# Altium schematic sheet DUAL_SIM_INTERFACE.SchDoc
size A4; SheetNumber: 17; SheetTotal: 27
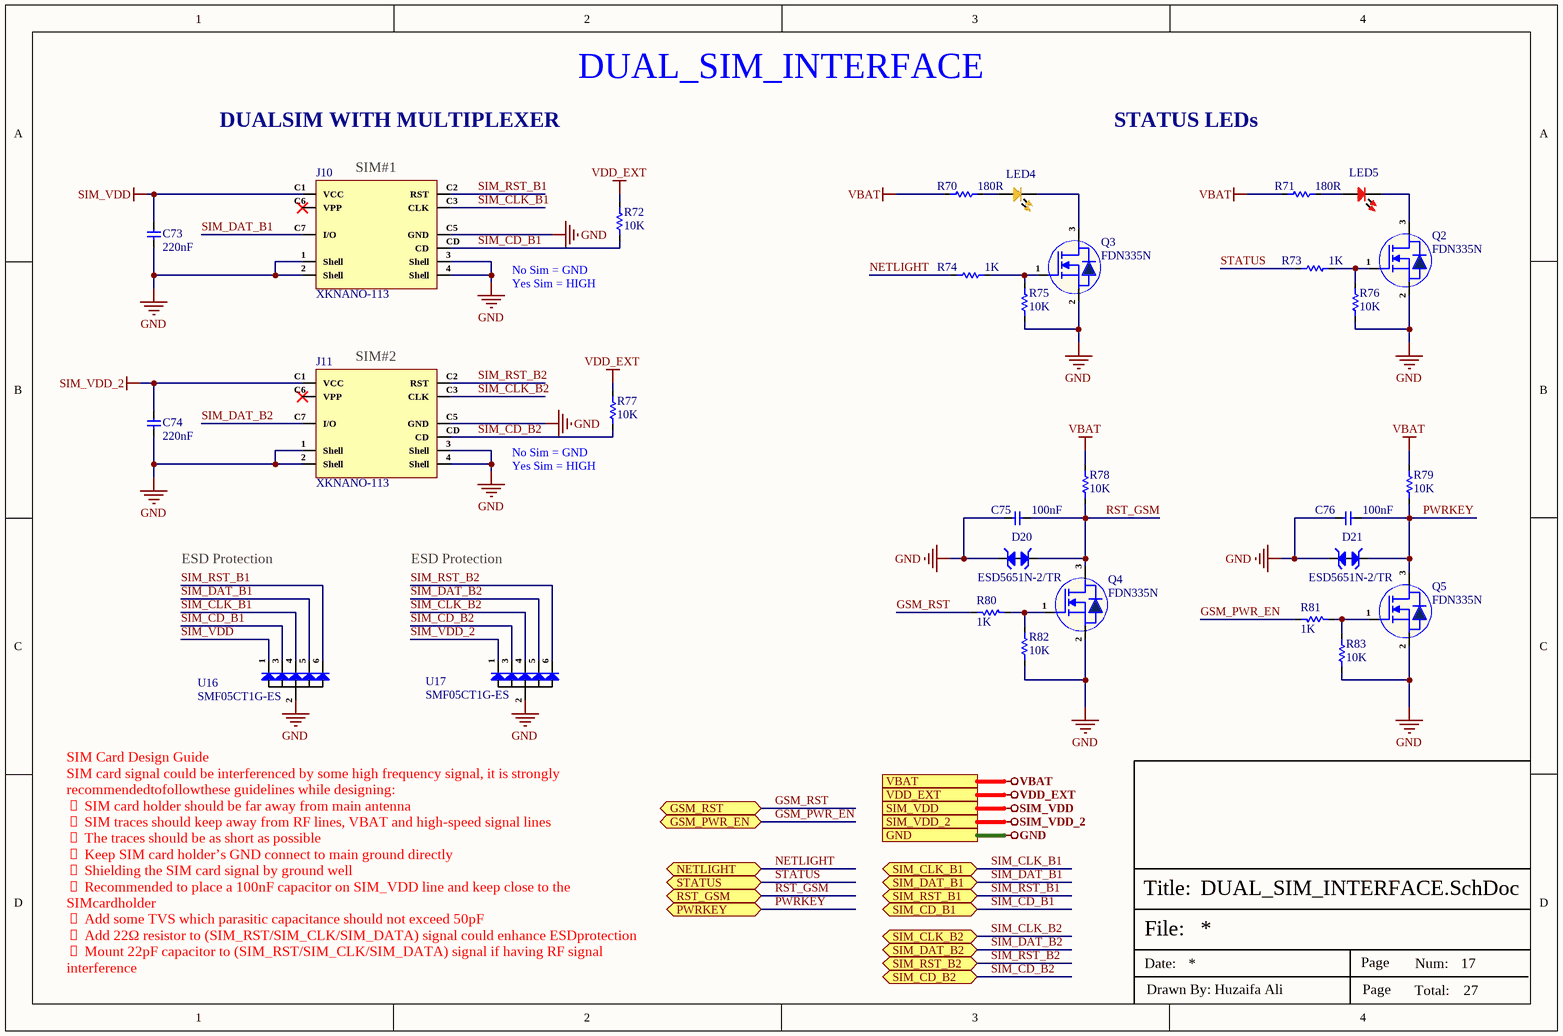
[diagram p0: DUAL_SIM_INTERFACE.SchDoc]

## Parts
C73  220nF  [Cap-0402]
C74  220nF  [Cap-0402]
C75  100nF  [Cap-0402]
C76  100nF  [Cap-0402]
D20  ESD5651N-2/TR  [DFN1006-2L_]
D21  ESD5651N-2/TR  [DFN1006-2L_]
J10  XKNANO-113  [XKNANO-113]
J11  XKNANO-113  [XKNANO-113]
LED4  Yellow  [LED-0402]  (value not drawn)
LED5  Red  [LED-0402]  (value not drawn)
Q2  FDN335N  [SOT-23]
Q3  FDN335N  [SOT-23]
Q4  FDN335N  [SOT-23]
Q5  FDN335N  [SOT-23]
R70  180R  [Res-0603]
R71  180R  [Res-0603]
R72  10K  [Res-0402]
R73  1K  [Res-0402]
R74  1K  [Res-0402]
R75  10K  [Res-0402]
R76  10K  [Res-0402]
R77  10K  [Res-0402]
R78  10K  [Res-0402]
R79  10K  [Res-0402]
R80  1K  [Res-0402]
R81  1K  [Res-0402]
R82  10K  [Res-0402]
R83  10K  [Res-0402]
U16  SMF05CT1G-ES  [SOT-363]
U17  SMF05CT1G-ES  [SOT-363]

## Ports
GND (see TOP SHEET[5B], AUDIO_INTERFACE[1D], BUCK REGULATOR[3D], DEBUG_UART_INTERFACE[3D], DIGITAL IO_RELAY_SHEET[5D], ETHERNET_PHY0[4D], ETHERNET_PHY1[4D], GSM_INTERFACE[2D], HDMI_INTERFACE[3D], INPUT_PROTECTION[3D], LINEAR_VOLTAGE_REG[3D], MICRO_SD_INTERFACE[3D], MIPI-DSI DISPLAY[3D], POWER SECTION[3D], PUSH BUTTONs_INTERFACE[3C], RGB_LEDs_INTERFACE[3D], ROCKCHIP_PWR_SUPPLY[1D], ROCKCHIP_SYSTEM_CONTROL[3C], RS232_RS485_INTERFACE[3C], SENSOR_SHEET[3D], USB2.0_INTERFACE[3D], USB3.0_INTERFACE[3D], USB-C_INTERFACE[2D], WIEGAND_INTERFACE[3D], WIFI_BLUETOOTH_SHEET[4C]), GSM_PWR_EN (bidir, see TOP SHEET[6B], ROCKCHIP_GPIO_NC PINS[3D]), GSM_RST (bidir, see TOP SHEET[6B], ROCKCHIP_GPIO_NC PINS[3D]), NETLIGHT (bidir, see TOP SHEET[5B], GSM_INTERFACE[3D]), PWRKEY (bidir, see TOP SHEET[5B], GSM_INTERFACE[3D]), RST_GSM (bidir, see TOP SHEET[5B], GSM_INTERFACE[3D]), SIM_CD_B1 (bidir, see TOP SHEET[5A], GSM_INTERFACE[3D]), SIM_CD_B2 (bidir, see TOP SHEET[5A], GSM_INTERFACE[3D]), SIM_CLK_B1 (bidir, see TOP SHEET[5A], GSM_INTERFACE[3D]), SIM_CLK_B2 (bidir, see TOP SHEET[5A], GSM_INTERFACE[3D]), SIM_DAT_B1 (bidir, see TOP SHEET[5A], GSM_INTERFACE[3D]), SIM_DAT_B2 (bidir, see TOP SHEET[5A], GSM_INTERFACE[3D]), SIM_RST_B1 (bidir, see TOP SHEET[5A], GSM_INTERFACE[3D]), SIM_RST_B2 (bidir, see TOP SHEET[5A], GSM_INTERFACE[3D]), SIM_VDD (see TOP SHEET[5A], GSM_INTERFACE[1D]), SIM_VDD_2 (see TOP SHEET[5A], GSM_INTERFACE[1D]), STATUS (bidir, see TOP SHEET[5B], GSM_INTERFACE[3D]), VBAT (see TOP SHEET[5B], GSM_INTERFACE[2D]), VDD_EXT (see TOP SHEET[5B], GSM_INTERFACE[2D])

## Nets
GND: C73.2 C74.2 C75.1 C76.1 D20.1(K) D21.1(K) J10.1(Shell) J10.2(Shell) J10.3(Shell) J10.4(Shell) J10.C5(GND) J11.1(Shell) J11.2(Shell) J11.3(Shell) J11.4(Shell) J11.C5(GND) Q2.2(S) Q3.2(S) Q4.2(S) Q5.2(S) R75.1 R76.1 R82.1 R83.1 U16.2(A) U17.2(A) ; port GND
SIM_VDD: C73.1 J10.C1(VCC) U16.1(IO1) ; port SIM_VDD
SIM_VDD_2: C74.1 J11.C1(VCC) U17.1(IO1) ; port SIM_VDD_2
VBAT: R70.2 R71.2 R78.2 R79.2 ; port VBAT
VDD_EXT: R72.2 R77.2 ; port VDD_EXT
GSM_PWR_EN: R81.2 ; port GSM_PWR_EN
GSM_RST: R80.1 ; port GSM_RST
NETLIGHT: R74.1 ; port NETLIGHT
PWRKEY: C76.2 D21.2(K) Q5.3(D) R79.1 ; port PWRKEY
RST_GSM: C75.2 D20.2(K) Q4.3(D) R78.1 ; port RST_GSM
SIM_CD_B1: J10.CD R72.1 U16.3(IO2) ; port SIM_CD_B1
SIM_CD_B2: J11.CD R77.1 U17.3(IO2) ; port SIM_CD_B2
SIM_CLK_B1: J10.C3(CLK) U16.4(IO3) ; port SIM_CLK_B1
SIM_CLK_B2: J11.C3(CLK) U17.4(IO3) ; port SIM_CLK_B2
SIM_DAT_B1: J10.C7(I/O) U16.5(IO4) ; port SIM_DAT_B1
SIM_DAT_B2: J11.C7(I/O) U17.5(IO4) ; port SIM_DAT_B2
SIM_RST_B1: J10.C2(RST) U16.6(IO5) ; port SIM_RST_B1
SIM_RST_B2: J11.C2(RST) U17.6(IO5) ; port SIM_RST_B2
STATUS: R73.1 ; port STATUS
NetLED4_1: LED4.1 R70.1
NetLED4_2: LED4.2 Q3.3(D)
NetLED5_1: LED5.1 R71.1
NetLED5_2: LED5.2 Q2.3(D)
NetQ2_1: Q2.1(G) R73.2 R76.2
NetQ3_1: Q3.1(G) R74.2 R75.2
NetQ4_1: Q4.1(G) R80.2 R82.2
NetQ5_1: Q5.1(G) R81.1 R83.2

Not connected (* = marked no-connect by the designer): J10 C6(VPP)*; J11 C6(VPP)*

## Notes on the sheet
- DUALSIM WITH MULTIPLEXER
- DUAL_SIM_INTERFACE
- STATUS LEDs
- (near J10) SIM#1
- (near R72) No Sim = GND
  Yes Sim = HIGH
- (near J11) SIM#2
- (near R77) No Sim = GND
  Yes Sim = HIGH
- ESD Protection
- SIM Card Design Guide
  SIM card signal could be interferenced by some high frequency signal, it is strongly recommendedtofollowthese guidelines while designing:
   SIM card holder should be far away from main antenna
   SIM traces should keep away from RF lines, VBAT and high-speed signal lines
   The traces should be as short as possible
   Keep SIM card holder’s GND connect to main ground directly
   Shielding the SIM card signal by ground well
   Recommended to place a 100nF capacitor on SIM_VDD line and keep close to the SIMcardholder
   Add some TVS which parasitic capacitance should not exceed 50pF
   Add 22Ω resistor to (SIM_RST/SIM_CLK/SIM_DATA) signal could enhance ESDprotection  Mount 22pF capacitor to (SIM_RST/SIM_CLK/SIM_DATA) signal if having RF signal interference
  Datasheet Pg 31
- File:
- Title:
- Date:
- Page
- Num:
- Total:
- Drawn By: Huzaifa Ali

## Library data of the parts
C73 C74 = CC0402KRX5R8BB224: CAP CER 0.22UF 25V X5R 0402; Manufacturer: Yageo; Tolerance: 10%; Manufacturer Part Number: CC0402KRX5R8BB224; RoHS: Yes; Category: Ceramic Capacitors; Supplier 1: Mouser; Stock 1: 61266; Pricing 1: 1=0.10000, 10=0.03300, 50=0.03300, 100=0.02700, 1000=0.01500, 10000=0.01300 (USD); Mount: Surface Mount; Case/Package: 0402; Min Operating Temperature: -55°C; Max Operating Temperature: 85°C; Capacitance: 220nF; Dielectric: X5R; Packaging: Tape and Reel; Voltage Rating: 25V; Voltage Rating (DC): 25V; Length: 0.039inch; Width: 0.02inch; Thickness: 0.022inch; Lead Free: Lead Free; Halogen Free: Halogen Free; RoHS Compliant: Yes; ComponentLink1URL: http://www.yageo.com/documents/recent/UPY-GPHC_X5R_4V-to-50V_25.pdf?src-supplier=Digi-Key; ComponentLink1Description: http://www.yageo.com/documents/recent/UPY-GPHC_X5R_4V-to-50V_25.pdf?src-supplier=Digi-Key; ComponentLink2URL: https://www.yageo.com/upload/media/product/productsearch/datasheet/mlcc/UPY-GPHC_X5R_4V-to-50V_26.pdf?src-supplier=Digi-Key; ComponentLink2Description: https://www.yageo.com/upload/media/product/productsearch/datasheet/mlcc/UPY-GPHC_X5R_4V-to-50V_26.pdf?src-supplier=Digi-Key; ComponentLink3URL: http://www.yageo.com/documents/recent/UPY-GPHC_X5R_4V-to-50V_23.pdf?src-supplier=Digi-Key; ComponentLink3Description: http://www.yageo.com/documents/recent/UPY-GPHC_X5R_4V-to-50V_23.pdf?src-supplier=Digi-Key; Supplier Part Number 1: 603-CC402KRX5R8BB224; LCSC Part Number: C326836
C75 C76 = CC0402KRX5R7BB104: CAP CER 0.1UF 16V X5R 0402; Manufacturer: Yageo; Tolerance: 10%; Manufacturer Part Number: CC0402KRX5R7BB104; RoHS: Yes; Category: Ceramic Capacitors; Supplier 1: Mouser; Stock 1: 936792; Pricing 1: 1=0.10000, 10=0.02300, 50=0.02300, 100=0.01100, 1000=0.00600, 10000=0.00400 (USD); Mount: Surface Mount; Case/Package: 0402; Number of Pins: 2; Case Code (Metric): 1005; Case Code (Imperial): 0402; Min Operating Temperature: -55°C; Max Operating Temperature: 85°C; Capacitance: 100nF; Dielectric: X5R; Packaging: Tape and Reel; Voltage Rating: 16V; Package Quantity: 1; Voltage Rating (DC): 16V; Termination: SMD/SMT; Resistor Type: Ceramic; Series: CC; Construction: Flat; Length: 1mm; Width: 0.02inch; Height: 0.5mm; Thickness: 0.022inch; Depth: 0.5mm; Radiation Hardening: No; REACH SVHC: Unknown; Lead Free: Lead Free; Halogen Free: Halogen Free; RoHS Compliant: Yes; ComponentLink1URL: https://datasheet.ciiva.com/155/mlccorderingcode-155879.pdf?src-supplier=Digi-Key; ComponentLink1Description: https://datasheet.ciiva.com/155/mlccorderingcode-155879.pdf?src-supplier=Digi-Key; ComponentLink2URL: https://datasheet.ciiva.com/155/mlccorderingcode-155878.pdf?src-supplier=Digi-Key; ComponentLink2Description: https://datasheet.ciiva.com/155/mlccorderingcode-155878.pdf?src-supplier=Digi-Key; ComponentLink3URL: https://datasheet.ciiva.com/155/mlccorderingcode-155880.pdf?src-supplier=Digi-Key; ComponentLink3Description: https://datasheet.ciiva.com/155/mlccorderingcode-155880.pdf?src-supplier=Digi-Key; ComponentLink4URL: https://datasheet.ciiva.com/11464/upy-gphc-x5r-4v-to-50v-12-11464869.pdf?src-supplier=Avnet; ComponentLink4Description: https://datasheet.ciiva.com/11464/upy-gphc-x5r-4v-to-50v-12-11464869.pdf?src-supplier=Avnet; Supplier Part Number 1: 603-CC402KRX5R7BB104; LCSC Part Number: C106204
D20 D21 = ESD5651N-2/TR: 35A@8/20us 15V 4.5V@Max DFN1006-2L Electrostatic and Surge Protection (TVS/ESD) ROHS; Manufacturer: WILLSEMI(Will Semicon); Item Type: Diode; Manufacturer Part Number: ESD5651N-2/TR; Package: DFN1006; LCSC Part Number: C239784; ComponentLink1Description: LCSC; ComponentLink1URL: https://www.lcsc.com/product-detail/TVS_WILLSEMI-Will-Semicon-ESD5651N-2-TR_C239784.html
J10 J11 = XKNANO-113: Copper Alloy Self bomb Gold plating 1.25mm Deck -40℃~+85℃ 260℃ NanoSIM SMD SIM Card Connectors ROHS; Manufacturer: XKB Connectivity; Manufacturer Part Number: XKNANO-113; Package: SMD Custom; LCSC Part Number: C381071; Item Type: SIM Card Connectors; ComponentLink1Description: LCSC; ComponentLink1URL: https://www.lcsc.com/product-detail/SIM-Card-Connectors_XKB-Connectivity-XKNANO-113_C381071.html
LED4 = XZMYK68W-2: LED YELLOW CLEAR CHIP SMD; Manufacturer: SunLED; Lens Color: Colorless; Luminous Intensity: 148mcd; Test Current: 20mA; Viewing Angle: 120°; Dominant Wavelength: 590nm; Forward Voltage: 2V; Supplier 1: Digi-Key; Manufacturer Part Number: XZMYK68W-2; RoHS: Yes; Category: LEDs; Stock 1: 36021; Pricing 1: 1=0.36000, 10=0.28400, 100=0.12770, 500=0.11536, 1000=0.09476 (USD); Mount: Surface Mount; Case/Package: 0402; Color: Yellow; Case Code (Metric): 1005; Case Code (Imperial): 0402; Packaging: Tape and Reel; Lens Transparency: Clear; Length: 1mm; Width: 0.5mm; Height: 0.6mm; RoHS Compliant: Yes; ComponentLink1URL: http://www.sunledusa.com/products/spec/XZMYK68W-2.pdf?src-supplier=Digi-Key; ComponentLink1Description: http://www.sunledusa.com/products/spec/XZMYK68W-2.pdf?src-supplier=Digi-Key; Supplier Part Number 1: 1497-1198-1-ND; Item Type: LED
LED5 = XZMDK68W-2: LED RED CLEAR CHIP SMD; Manufacturer: SunLED; Lens Color: Colorless; Luminous Intensity: 69mcd; Test Current: 20mA; Viewing Angle: 120°; Dominant Wavelength: 630nm; Forward Voltage: 1.95V; Supplier 1: Digi-Key; Manufacturer Part Number: XZMDK68W-2; Stock 1: 69539; Pricing 1: 1=0.43, 10=0.306, 100=0.136, 500=0.0952, 1000=0.0782 (USD); Mount: Surface Mount; Case/Package: 0402; Color: Red; Case Code (Metric): 1005; Case Code (Imperial): 0402; Packaging: Tape and Reel; Lens Transparency: Clear; Length: 1mm; Height: 0.6mm; Width: 0.5mm; ComponentLink1URL: http://www.sunledusa.com/products/spec/XZMDK68W-2.pdf?src-supplier=Digi-Key; ComponentLink1Description: http://www.sunledusa.com/products/spec/XZMDK68W-2.pdf?src-supplier=Digi-Key; ComponentLink2URL: https://www.sunledusa.com/products/spec/XZMDK68W-2.pdf?src-supplier=Digi-Key; ComponentLink2Description: https://www.sunledusa.com/products/spec/XZMDK68W-2.pdf?src-supplier=Digi-Key; Supplier Part Number 1: 1497-1174-6-ND; Item Type: LED
Q2-Q5 = FDN335N: SOT-23 MOSFETs ROHS; Manufacturer: TECH PUBLIC; Item Type: Mosfet; Manufacturer Part Number: FDN335N; Package: SOT-23; LCSC Part Number: C5123904; ComponentLink1Description: LCSC; ComponentLink1URL: https://www.lcsc.com/product-detail/MOSFETs_TECH-PUBLIC-FDN335N_C5123904.html
R70 R71 = RC0603FR-07180RL: RES 180 OHM 1% 1/10W 0603; Manufacturer: Yageo; Max Power Dissipation: 100mW; Temperature Coefficient: 100ppm/°C; Item Type: Resistor; Voltage Rating (DC): 50V; Manufacturer Part Number: RC0603FR-07180RL; RoHS: Yes; Category: Chip SMD Resistors; Case/Package: 0603; Min Operating Temperature: -55°C; Max Operating Temperature: 155°C; Packaging: Tape and Reel; Number of Terminations: 2; Tolerance: 1%; Features: Moisture Resistant; Series: RC; Length: 1.6mm; Width: 0.8mm; Height: 0.022inch; RoHS Compliant: Yes; ComponentLink1URL: https://datasheet.ciiva.com/2454/pyu-r-int-thick-7-2454469.pdf?src-supplier=Digi-Key; ComponentLink1Description: https://datasheet.ciiva.com/2454/pyu-r-int-thick-7-2454469.pdf?src-supplier=Digi-Key; ComponentLink2URL: https://datasheet.ciiva.com/2454/pyu-r-int-thick-7-2454470.pdf?src-supplier=Digi-Key; ComponentLink2Description: https://datasheet.ciiva.com/2454/pyu-r-int-thick-7-2454470.pdf?src-supplier=Digi-Key; LCSC Part Number: C137786; Supplier 1: Avnet; Stock 1: 35000; Pricing 1: 5000=0.00133, 10000=0.00131, 20000=0.00127 (USD); Number of Pins: 2; Case Code (Metric): 1608; Case Code (Imperial): 0603; Size Code: 0603; Resistance: 180R; Power Rating: 100mW; Package Quantity: 1; Voltage Rating: 50V; Resistor Type: Thick Film; Termination: SMD/SMT; Construction: Rectangular; Resistance Tolerance: 1%; Depth: 0.8mm; Lead Free: Lead Free; Military Standard: Not; ComponentLink3URL: https://datasheet.ciiva.com/2454/pyu-r-int-thick-7-2454468.pdf?src-supplier=Digi-Key; ComponentLink3Description: https://datasheet.ciiva.com/2454/pyu-r-int-thick-7-2454468.pdf?src-supplier=Digi-Key; ComponentLink4URL: https://datasheet.ciiva.com/7746/443971-7746267.pdf?src-supplier=Element14; ComponentLink4Description: https://datasheet.ciiva.com/7746/443971-7746267.pdf?src-supplier=Element14; ComponentLink5URL: https://datasheet.ciiva.com/7746/443971-7746266.pdf?src-supplier=Element14; ComponentLink5Description: https://datasheet.ciiva.com/7746/443971-7746266.pdf?src-supplier=Element14; ComponentLink6URL: https://datasheet.ciiva.com/15189/getdatasheetpartid-325160-15189622.pdf?src-supplier=Verical; ComponentLink6Description: https://datasheet.ciiva.com/15189/getdatasheetpartid-325160-15189622.pdf?src-supplier=Verical; Supplier Part Number 1: RC0603FR-07180RL
R72 R77-R79 R82 R83 = RC0402FR-0710KL: RES 10K OHM 1% 1/16W 0402; Manufacturer: Yageo; Max Power Dissipation: 63mW; Temperature Coefficient: 100ppm/°C; Resistance: 10kR; Voltage Rating (DC): 50V; Power Rating: 62.5mW; Item Type: Resistor; Manufacturer Part Number: RC0402FR-0710KL; RoHS: Yes; Category: Chip SMD Resistors; Case/Package: 0402; Case Code (Imperial): 0402; Case Code (Metric): 1005; Min Operating Temperature: -55°C; Max Operating Temperature: 155°C; Features: Moisture Resistant; Packaging: Tape and Reel; Tolerance: 1%; Number of Terminations: 2; Series: RC; RoHS Compliant: Yes; ComponentLink1URL: https://datasheet.ciiva.com/7660/38568-7660787.pdf?src-supplier=Element14; ComponentLink1Description: https://datasheet.ciiva.com/7660/38568-7660787.pdf?src-supplier=Element14; Supplier 1: Mouser; Stock 1: 18648329; Pricing 1: 1=0.10000, 10=0.01400, 50=0.01400, 100=0.00500, 1000=0.00300, 10000=0.00200 (USD); Number of Pins: 2; Resistor Type: Thick Film; Voltage Rating: 50V; Termination: SMD/SMT; Resistance Tolerance: 1%; Construction: Rectangular; Length: 1mm; Width: 0.5mm; Height: 0.32mm; Depth: 0.5mm; Lead Pitch: 0.2mm; REACH SVHC: No SVHC; Lead Free: Lead Free; Military Standard: Not; ComponentLink2URL: https://datasheet.ciiva.com/7849/1686128-7849814.pdf?src-supplier=Element14; ComponentLink2Description: https://datasheet.ciiva.com/7849/1686128-7849814.pdf?src-supplier=Element14; ComponentLink3URL: https://datasheet.ciiva.com/7983/1018594-7983486.pdf?src-supplier=Element14; ComponentLink3Description: https://datasheet.ciiva.com/7983/1018594-7983486.pdf?src-supplier=Element14; ComponentLink4URL: https://datasheet.ciiva.com/22747/1018594-22747512.pdf?src-supplier=Element14; ComponentLink4Description: https://datasheet.ciiva.com/22747/1018594-22747512.pdf?src-supplier=Element14; ComponentLink5URL: https://datasheet.ciiva.com/12667/pyu-rc0402-51-rohs-l-6-r-12667067.pdf?src-supplier=Mouser; ComponentLink5Description: https://datasheet.ciiva.com/12667/pyu-rc0402-51-rohs-l-6-r-12667067.pdf?src-supplier=Mouser; ComponentLink6URL: https://datasheet.ciiva.com/7849/1784430-7849813.pdf?src-supplier=Element14; ComponentLink6Description: https://datasheet.ciiva.com/7849/1784430-7849813.pdf?src-supplier=Element14; Supplier Part Number 1: 603-RC0402FR-0710KL; LCSC Part Number: C60490; Working Voltage: 50V; ComponentLink7URL: https://datasheet.ciiva.com/7849/1784430-7849815.pdf?src-supplier=Element14; ComponentLink7Description: https://datasheet.ciiva.com/7849/1784430-7849815.pdf?src-supplier=Element14
R73 R74 R80 R81 = RC0402FR-071KL: RES 1K OHM 1% 1/16W 0402; Manufacturer: Yageo; Resistance: 1kR; Temperature Coefficient: 100ppm/°C; Voltage Rating (DC): 50V; Power Rating: 62.5mW; Max Power Dissipation: 63mW; Item Type: Resistor; Supplier 1: Avnet; Manufacturer Part Number: RC0402FR-071KL; RoHS: Yes; Stock 1: 13030000; Pricing 1: 10000=0.00085, 20000=0.00087, 40000=0.00084, 60000=0.00083, 80000=0.00079, 100000=0.00078, 1000000=0.00076 (USD); RoHS Compliant: Yes; Supplier Part Number 1: RC0402FR-071KL; LCSC Part Number: C106235; Category: Chip SMD Resistors; Case/Package: 0402; Number of Pins: 2; Case Code (Imperial): 0402; Case Code (Metric): 1005; Size Code: 0402; Min Operating Temperature: -55°C; Max Operating Temperature: 155°C; Resistor Type: Thick Film; Tolerance: 1%; Packaging: Tape and Reel; Voltage Rating: 50V; Termination: SMD/SMT; Features: Moisture Resistant; Series: RC; Number of Terminations: 2; Resistance Tolerance: 1%; Construction: Rectangular; Technology: THICK FILM; Length: 1mm; Width: 0.5mm; Height: 0.32mm; Depth: 0.5mm; Reach SVHC Compliant: Yes; Lead Free: Lead Free; Military Standard: Not; ComponentLink1URL: https://datasheet.ciiva.com/11819/0900766b80c66297-11819477.pdf?src-supplier=RSComponents; ComponentLink1Description: https://datasheet.ciiva.com/11819/0900766b80c66297-11819477.pdf?src-supplier=RSComponents; ComponentLink2URL: https://datasheet.ciiva.com/7983/1018594-7983502.pdf?src-supplier=Element14; ComponentLink2Description: https://datasheet.ciiva.com/7983/1018594-7983502.pdf?src-supplier=Element14; ComponentLink3URL: https://datasheet.ciiva.com/22747/1018594-22747513.pdf?src-supplier=Element14; ComponentLink3Description: https://datasheet.ciiva.com/22747/1018594-22747513.pdf?src-supplier=Element14; ComponentLink4URL: https://datasheet.ciiva.com/12666/pyu-rc0402-51-rohs-l-6-r-12666741.pdf?src-supplier=Mouser; ComponentLink4Description: https://datasheet.ciiva.com/12666/pyu-rc0402-51-rohs-l-6-r-12666741.pdf?src-supplier=Mouser; ComponentLink5URL: https://datasheet.ciiva.com/7849/1018594-7849869.pdf?src-supplier=Element14; ComponentLink5Description: https://datasheet.ciiva.com/7849/1018594-7849869.pdf?src-supplier=Element14; ComponentLink6URL: https://datasheet.ciiva.com/7849/1018594-7849871.pdf?src-supplier=Element14; ComponentLink6Description: https://datasheet.ciiva.com/7849/1018594-7849871.pdf?src-supplier=Element14; ComponentLink7URL: https://datasheet.ciiva.com/17063/pyu-rc0402-51-rohs-l-6-r-17063193.pdf?src-supplier=Future+Electronics; ComponentLink7Description: https://datasheet.ciiva.com/17063/pyu-rc0402-51-rohs-l-6-r-17063193.pdf?src-supplier=Future+Electronics
R75 R76 = RC0402FR-0710KL: RES 10K OHM 1% 1/16W 0402; Manufacturer: Yageo; Item Type: Resistor; Resistance: 10kR; Voltage Rating (DC): 50V; Temperature Coefficient: 100ppm/°C; Power Rating: 62.5mW; Max Power Dissipation: 63mW; Manufacturer Part Number: RC0402FR-0710KL; ComponentLink7Description: https://datasheet.ciiva.com/7849/1784430-7849815.pdf?src-supplier=Element14; ComponentLink7URL: https://datasheet.ciiva.com/7849/1784430-7849815.pdf?src-supplier=Element14; LCSC Part Number: C60490; Supplier 1: Mouser; RoHS: Yes; Category: Chip SMD Resistors; Stock 1: 18648329; Pricing 1: 1=0.10000, 10=0.01400, 50=0.01400, 100=0.00500, 1000=0.00300, 10000=0.00200 (USD); Case/Package: 0402; Number of Pins: 2; Case Code (Imperial): 0402; Case Code (Metric): 1005; Min Operating Temperature: -55°C; Max Operating Temperature: 155°C; Resistor Type: Thick Film; Tolerance: 1%; Packaging: Tape and Reel; Voltage Rating: 50V; Termination: SMD/SMT; Working Voltage: 50V; Number of Terminations: 2; Features: Moisture Resistant; Series: RC; Resistance Tolerance: 1%; Construction: Rectangular; Length: 1mm; Width: 0.5mm; Height: 0.32mm; Depth: 0.5mm; Lead Pitch: 0.2mm; REACH SVHC: No SVHC; Lead Free: Lead Free; RoHS Compliant: Yes; Military Standard: Not; ComponentLink1URL: https://datasheet.ciiva.com/7660/38568-7660787.pdf?src-supplier=Element14; ComponentLink1Description: https://datasheet.ciiva.com/7660/38568-7660787.pdf?src-supplier=Element14; ComponentLink2URL: https://datasheet.ciiva.com/7849/1686128-7849814.pdf?src-supplier=Element14; ComponentLink2Description: https://datasheet.ciiva.com/7849/1686128-7849814.pdf?src-supplier=Element14; ComponentLink3URL: https://datasheet.ciiva.com/7983/1018594-7983486.pdf?src-supplier=Element14; ComponentLink3Description: https://datasheet.ciiva.com/7983/1018594-7983486.pdf?src-supplier=Element14; ComponentLink4URL: https://datasheet.ciiva.com/22747/1018594-22747512.pdf?src-supplier=Element14; ComponentLink4Description: https://datasheet.ciiva.com/22747/1018594-22747512.pdf?src-supplier=Element14; ComponentLink5URL: https://datasheet.ciiva.com/12667/pyu-rc0402-51-rohs-l-6-r-12667067.pdf?src-supplier=Mouser; ComponentLink5Description: https://datasheet.ciiva.com/12667/pyu-rc0402-51-rohs-l-6-r-12667067.pdf?src-supplier=Mouser; ComponentLink6URL: https://datasheet.ciiva.com/7849/1784430-7849813.pdf?src-supplier=Element14; ComponentLink6Description: https://datasheet.ciiva.com/7849/1784430-7849813.pdf?src-supplier=Element14; Supplier Part Number 1: 603-RC0402FR-0710KL
U16 U17 = SMF05CT1G-ES: 15V 5 Unidirectional 5V SOT-363 ESD Protection Devices ROHS; Manufacturer: ElecSuper; Item Type: ESD Diode; Manufacturer Part Number: SMF05CT1G-ES; Package: SOT-363; LCSC Part Number: C5180312; ComponentLink1Description: LCSC; ComponentLink1URL: https://www.lcsc.com/product-detail/ESD-Protection-Devices_ElecSuper-SMF05CT1G-ES_C5180312.html